# EAGLE schematic uTTA_V1_Measure (EAGLE 6.3)
VERSION: HW1.00
Assembly variants: Manual_Adjust, Controller Adjust

## Sheet 1 of 5: uC & Flash
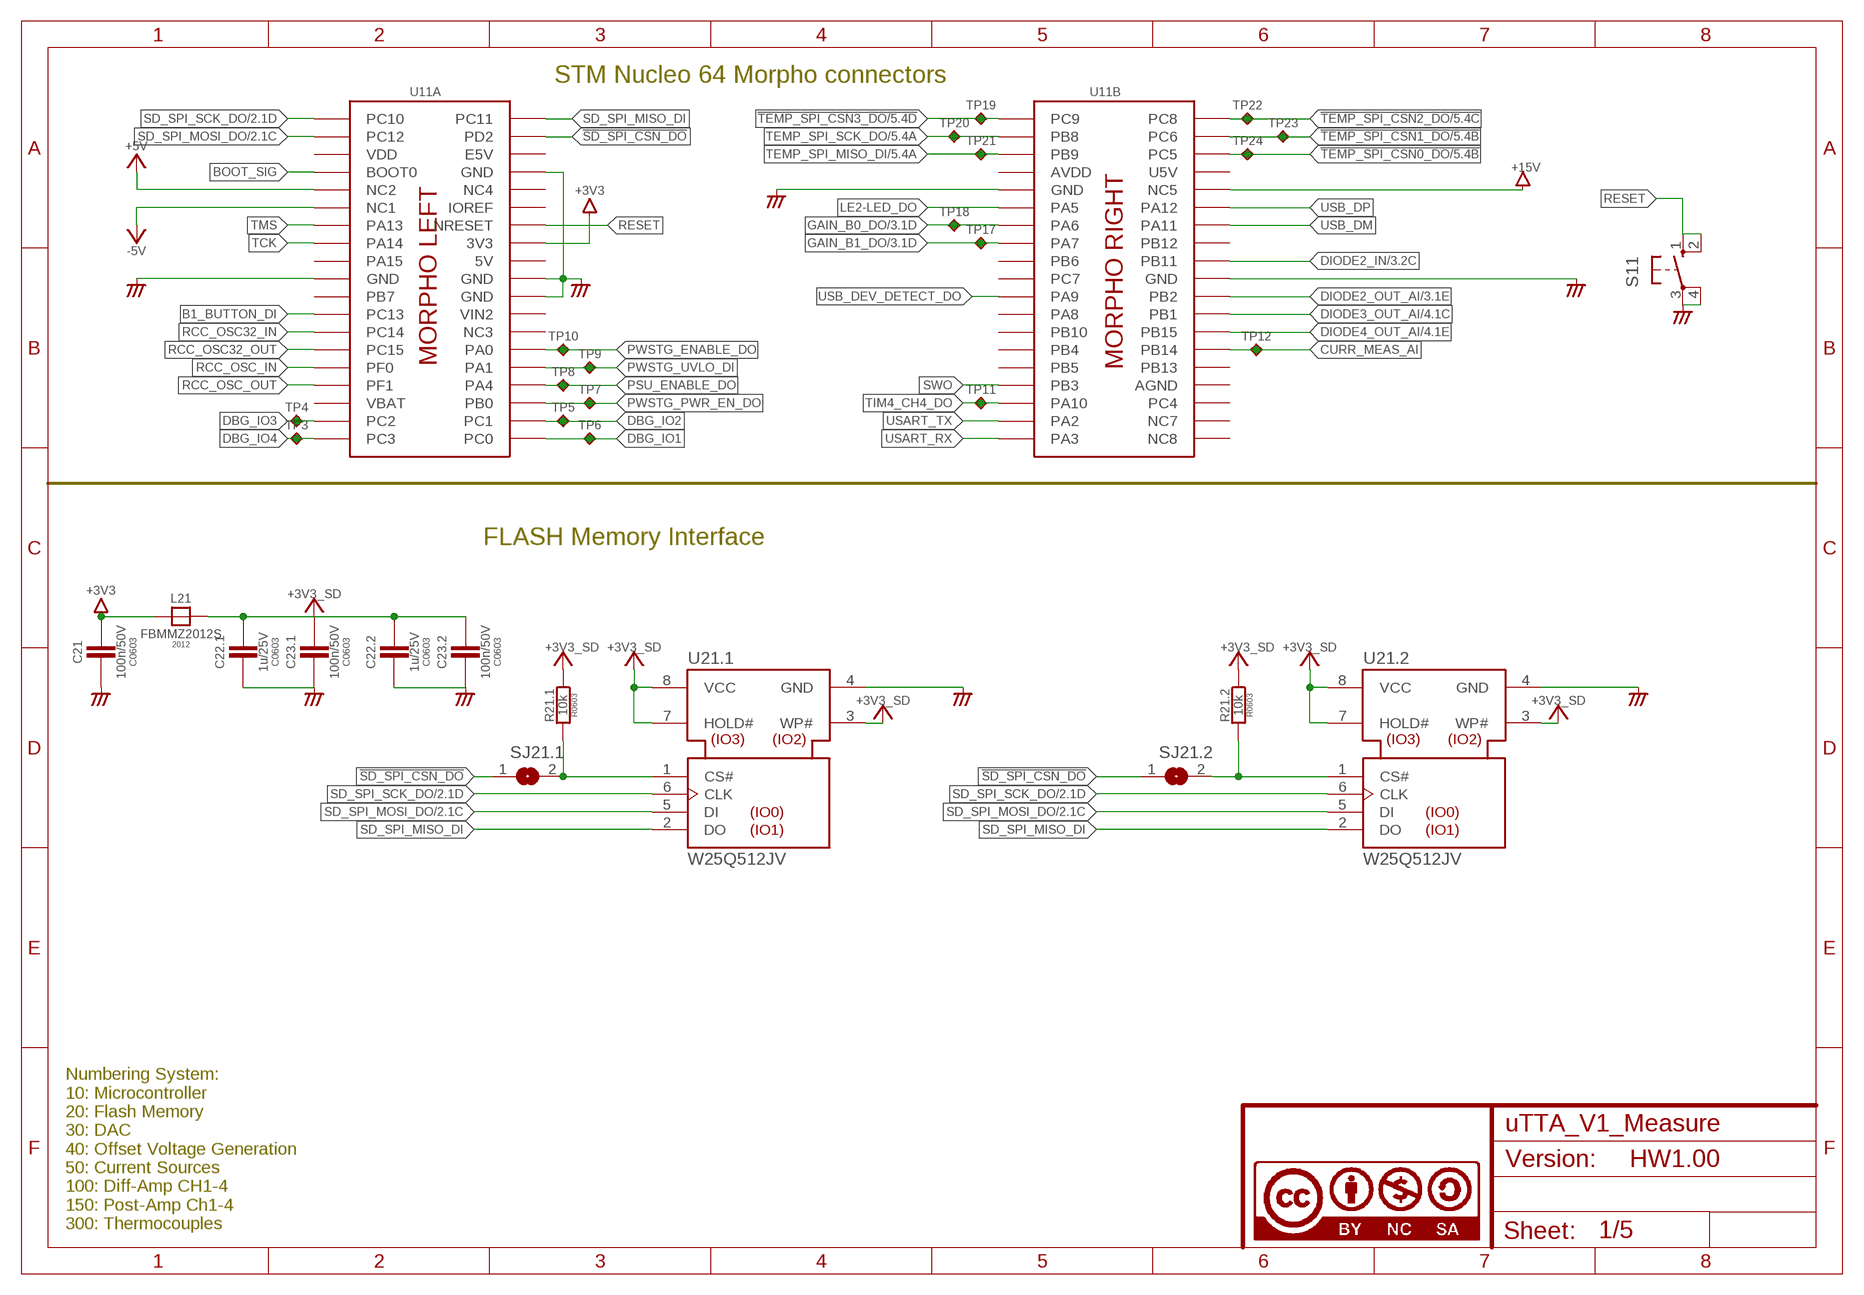
[diagram p0: schematic, sheet 1]

### Parts
C21  100n/50V  C-EUC0603  [C0603]
C22.1  1u/25V  C-EUC0603  [C0603]
C22.2  1u/25V  C-EUC0603  [C0603]
C23.1  100n/50V  C-EUC0603  [C0603]
C23.2  100n/50V  C-EUC0603  [C0603]
L21  FBMMZ2012S  [FB2012]
R21.1  10k  R-EU_R0603  [R0603]
R21.2  10k  R-EU_R0603  [R0603]
S11  10-XX  [B3F-10XX]
SJ21.1  SJ  [SJ]
SJ21.2  SJ  [SJ]
TP3  TPC90H30  [C90H30]
TP4  TPC90H30  [C90H30]
TP5  TPC90H30  [C90H30]
TP6  TPC90H30  [C90H30]
TP7  TPC90H30  [C90H30]
TP8  TPC90H30  [C90H30]
TP9  TPC90H30  [C90H30]
TP10  TPC90H30  [C90H30]
TP11  TPC90H30  [C90H30]
TP12  TPC90H30  [C90H30]
TP17  TPC90H30  [C90H30]
TP18  TPC90H30  [C90H30]
TP19  TPC90H30  [C90H30]
TP20  TPC90H30  [C90H30]
TP21  TPC90H30  [C90H30]
TP22  TPC90H30  [C90H30]
TP23  TPC90H30  [C90H30]
TP24  TPC90H30  [C90H30]
U11  NUCLEO_F103_BOT  [NUCLEO_BRD64_LOWER]
U21.1  W25Q512JV  W25Q80BVSSIG  [SO08W]
U21.2  W25Q512JV  W25Q80BVSSIG  [SO08W]
U$3  A4L-LOC_CC_BY_NC_SA  [A4_LOC_CC_BY_NC_SA]

### Nets
!SD_SPI_CSN_DO [Power]: SJ21.1.1 SJ21.2.1 U11.L_PD2(A:PD2)
!TEMP_SPI_CSN0_DO [Power]: TP24.P$1(TP) U11.R_PC5(B:PC5) ; also sheet 5
!TEMP_SPI_CSN1_DO [Power]: TP23.P$1(TP) U11.R_PC6(B:PC6) ; also sheet 5
!TEMP_SPI_CSN2_DO [Power]: TP22.P$1(TP) U11.R_PC8(B:PC8) ; also sheet 5
!TEMP_SPI_CSN3_DO [Power]: TP19.P$1(TP) U11.R_PC9(B:PC9) ; also sheet 5
+3V3: C21.1 L21.1 U11.L_3V3(A:3V3) ; also sheet 2,3,4,5
+5V [Analog_Sig]: U11.L_NC2(A:NC2) ; also sheet 2,3,4
+5V/4 [Analog_Sig]: C22.1.1 C22.2.1 C23.1.1 C23.2.1 L21.2 R21.1.1 R21.2.1 U21.1.3(WP#) U21.1.7(HOLD#) U21.1.8(VCC) U21.2.3(WP#) U21.2.7(HOLD#) U21.2.8(VCC) ; supply symbol labelled +3V3_SD
+15V [Analog_Sig]: U11.R_NC5(B:NC5)
-5V [Analog_Sig]: U11.L_NC1(A:NC1) ; also sheet 2,3,4
AGND [Analog_Sig]: C21.2 C22.1.2 C22.2.2 C23.1.2 C23.2.2 S11.3(P) S11.4(P1) U11.L_GND3(A:GND) U11.L_GND4(A:GND) U11.L_GND5(A:GND) U11.L_GND(A:GND) U11.R_GND7(B:GND) U11.R_GND8(B:GND) U21.1.4(GND) U21.2.4(GND) ; supply symbol labelled AGND_ ; also sheet 2,3,4,5
B1_BUTTON_DI: U11.L_PC13(A:PC13)
BOOT_SIG: U11.L_BOOT0(A:BOOT0)
CURR_MEAS_AI [Digital_Sig]: TP12.P$1(TP) U11.R_PB14(B:PB14)
DBG_IO1: TP6.P$1(TP) U11.L_PC0(A:PC0)
DBG_IO2: TP5.P$1(TP) U11.L_PC1(A:PC1)
DBG_IO3: TP4.P$1(TP) U11.L_PC2(A:PC2)
DBG_IO4: TP3.P$1(TP) U11.L_PC3(A:PC3)
DIODE2_IN [Analog_Sig]: U11.R_PB11(B:PB11) ; also sheet 3
DIODE2_OUT_AI [Digital_Sig]: U11.R_PB2(B:PB2) ; also sheet 3
DIODE3_OUT_AI [Digital_Sig]: U11.R_PB1(B:PB1) ; also sheet 4
DIODE4_OUT_AI [Digital_Sig]: U11.R_PB15(B:PB15) ; also sheet 4
GAIN_B0_DO [Power]: TP18.P$1(TP) U11.R_PA6(B:PA6) ; also sheet 3
GAIN_B1_DO [Power]: TP17.P$1(TP) U11.R_PA7(B:PA7) ; also sheet 3
LE2-LED_DO: U11.R_PA5(B:PA5)
N$5: R21.1.2 SJ21.1.2 U21.1.1(CS#)
N$6: R21.2.2 SJ21.2.2 U21.2.1(CS#)
PSU_ENABLE_DO: TP8.P$1(TP) U11.L_PA4(A:PA4)
PWSTG_ENABLE_DO: TP10.P$1(TP) U11.L_PA0(A:PA0)
PWSTG_PWR_EN_DO: TP7.P$1(TP) U11.L_PB0(A:PB0)
PWSTG_UVLO_DI: TP9.P$1(TP) U11.L_PA1(A:PA1)
RCC_OSC32_IN: U11.L_PC14(A:PC14)
RCC_OSC32_OUT: U11.L_PC15(A:PC15)
RCC_OSC_IN: U11.L_PF0(A:PF0)
RCC_OSC_OUT: U11.L_PF1(A:PF1)
RESET [Power]: S11.1(S) S11.2(S1) U11.L_RESET(A:NRESET)
SD_SPI_MISO_DI [Power]: U11.L_PC11(A:PC11) U21.1.2(DO) U21.2.2(DO)
SD_SPI_MOSI_DO [Power]: U11.L_PC12(A:PC12) U21.1.5(DI) U21.2.5(DI) ; also sheet 2
SD_SPI_SCK_DO [Power]: U11.L_PC10(A:PC10) U21.1.6(CLK) U21.2.6(CLK) ; also sheet 2
SWO: U11.R_PB3(B:PB3)
TCK: U11.L_PA14(A:PA14)
TEMP_SPI_MISO_DI [Power]: TP21.P$1(TP) U11.R_PB9(B:PB9) ; also sheet 5
TEMP_SPI_SCK_DO [Power]: TP20.P$1(TP) U11.R_PB8(B:PB8) ; also sheet 5
TIM4_CH4_DO [Power]: TP11.P$1(TP) U11.R_PA10(B:PA10)
TMS: U11.L_PA13(A:PA13)
USART_RX: U11.R_PA3(B:PA3)
USART_TX: U11.R_PA2(B:PA2)
USB_DEV_DETECT_DO: U11.R_PA9(B:PA9)
USB_DM: U11.R_PA11(B:PA11)
USB_DP: U11.R_PA12(B:PA12)
Unconnected: U11.L_IOREF(A:IOREF) U11.L_NC3(A:NC3) U11.L_NC4(A:NC4) U11.L_PA15(A:PA15) U11.L_PB7(A:PB7) U11.R_NC7(B:NC7) U11.R_NC8(B:NC8) U11.R_PA8(B:PA8) U11.R_PB4(B:PB4) U11.R_PB5(B:PB5) U11.R_PB6(B:PB6) U11.R_PB10(B:PB10) U11.R_PB12(B:PB12) U11.R_PB13(B:PB13) U11.R_PC4(B:PC4) U11.R_PC7(B:PC7)

### Notes on the sheet
- STM Nucleo 64 Morpho connectors
- FLASH Memory Interface
- Numbering System:
  10: Microcontroller
  20: Flash Memory
  30: DAC
  40: Offset Voltage Generation
  50: Current Sources
  100: Diff-Amp CH1-4
  150: Post-Amp Ch1-4
  300: Thermocouples

## Sheet 2 of 5
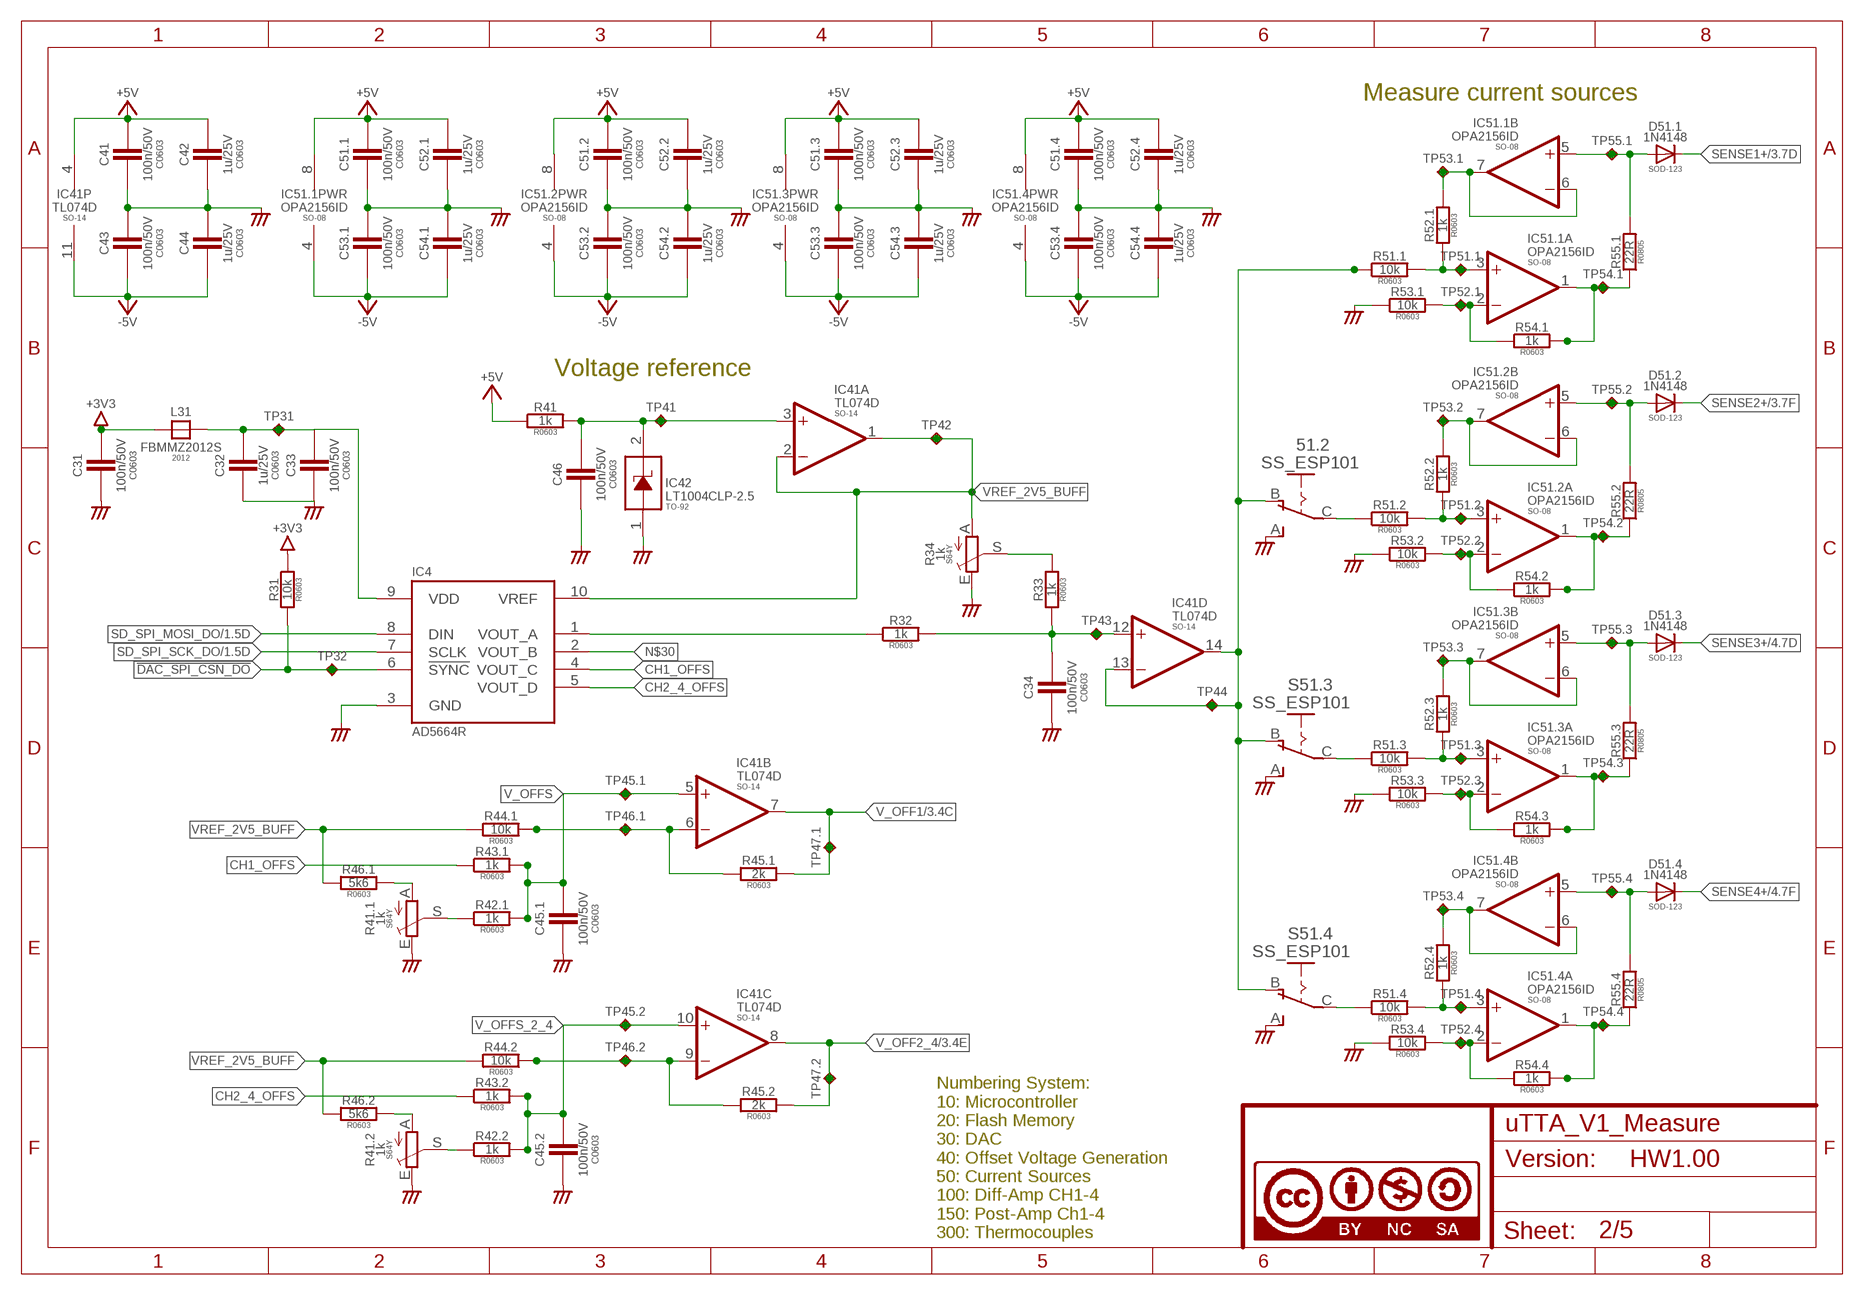
[diagram p1: schematic, sheet 2]

### Parts
51.2  SS_ESP101  [SS_ESP101]
C31  100n/50V  C-EUC0603  [C0603]  (not fitted in variant Manual_Adjust)
C32  1u/25V  C-EUC0603  [C0603]
C33  100n/50V  C-EUC0603  [C0603]  (not fitted in variant Manual_Adjust)
C34  100n/50V  C-EUC0603  [C0603]
C41  100n/50V  C-EUC0603  [C0603]
C42  1u/25V  C-EUC0603  [C0603]
C43  100n/50V  C-EUC0603  [C0603]
C44  1u/25V  C-EUC0603  [C0603]
C45.1  100n/50V  C-EUC0603  [C0603]
C45.2  100n/50V  C-EUC0603  [C0603]
C46  100n/50V  C-EUC0603  [C0603]
C51.1  100n/50V  C-EUC0603  [C0603]
C51.2  100n/50V  C-EUC0603  [C0603]
C51.3  100n/50V  C-EUC0603  [C0603]
C51.4  100n/50V  C-EUC0603  [C0603]
C52.1  1u/25V  C-EUC0603  [C0603]
C52.2  1u/25V  C-EUC0603  [C0603]
C52.3  1u/25V  C-EUC0603  [C0603]
C52.4  1u/25V  C-EUC0603  [C0603]
C53.1  100n/50V  C-EUC0603  [C0603]
C53.2  100n/50V  C-EUC0603  [C0603]
C53.3  100n/50V  C-EUC0603  [C0603]
C53.4  100n/50V  C-EUC0603  [C0603]
C54.1  1u/25V  C-EUC0603  [C0603]
C54.2  1u/25V  C-EUC0603  [C0603]
C54.3  1u/25V  C-EUC0603  [C0603]
C54.4  1u/25V  C-EUC0603  [C0603]
D51.1  1N4148  DIODE-SOD123  [SOD123]
D51.2  1N4148  DIODE-SOD123  [SOD123]
D51.3  1N4148  DIODE-SOD123  [SOD123]
D51.4  1N4148  DIODE-SOD123  [SOD123]
IC4  AD5664R  [MSOP10]  (not fitted in variant Manual_Adjust)
IC41  TL074D  [SO14]
IC42  LT1004CLP-2.5  [TO92-]
IC51.1  OPA2156ID  [SO08]
IC51.2  OPA2156ID  [SO08]
IC51.3  OPA2156ID  [SO08]
IC51.4  OPA2156ID  [SO08]
L31  FBMMZ2012S  [FB2012]  (not fitted in variant Manual_Adjust)
R31  10k  R-EU_R0603  [R0603]  (not fitted in variant Manual_Adjust)
R32  1k  R-EU_R0603  [R0603]  (not fitted in variant Manual_Adjust)
R33  1k  R-EU_R0603  [R0603]  (not fitted in variant Controller Adjust)
R34  1k  TRIM_EU-S64Y  [S64Y]  (not fitted in variant Controller Adjust)
R41  1k  R-EU_R0603  [R0603]
R41.1  1k  TRIM_EU-S64Y  [S64Y]  (not fitted in variant Controller Adjust)
R41.2  1k  TRIM_EU-S64Y  [S64Y]  (not fitted in variant Controller Adjust)
R42.1  1k  R-EU_R0603  [R0603]  (not fitted in variant Controller Adjust)
R42.2  1k  R-EU_R0603  [R0603]  (not fitted in variant Controller Adjust)
R43.1  1k  R-EU_R0603  [R0603]  (not fitted in variant Manual_Adjust)
R43.2  1k  R-EU_R0603  [R0603]  (not fitted in variant Manual_Adjust)
R44.1  10k  R-EU_R0603  [R0603]
R44.2  10k  R-EU_R0603  [R0603]
R45.1  2k  R-EU_R0603  [R0603]
R45.2  2k  R-EU_R0603  [R0603]
R46.1  5k6  R-EU_R0603  [R0603]
R46.2  5k6  R-EU_R0603  [R0603]
R51.1  10k  R-EU_R0603  [R0603]
R51.2  10k  R-EU_R0603  [R0603]
R51.3  10k  R-EU_R0603  [R0603]
R51.4  10k  R-EU_R0603  [R0603]
R52.1  1k  R-EU_R0603  [R0603]
R52.2  1k  R-EU_R0603  [R0603]
R52.3  1k  R-EU_R0603  [R0603]
R52.4  1k  R-EU_R0603  [R0603]
R53.1  10k  R-EU_R0603  [R0603]
R53.2  10k  R-EU_R0603  [R0603]
R53.3  10k  R-EU_R0603  [R0603]
R53.4  10k  R-EU_R0603  [R0603]
R54.1  1k  R-EU_R0603  [R0603]
R54.2  1k  R-EU_R0603  [R0603]
R54.3  1k  R-EU_R0603  [R0603]
R54.4  1k  R-EU_R0603  [R0603]
R55.1  22R  R-EU_R0805  [R0805]
R55.2  22R  R-EU_R0805  [R0805]
R55.3  22R  R-EU_R0805  [R0805]
R55.4  22R  R-EU_R0805  [R0805]
S51.3  SS_ESP101  [SS_ESP101]
S51.4  SS_ESP101  [SS_ESP101]
TP31  TP  [C90]
TP32  TP  [C90]
TP41  TP  [C90]
TP42  TP  [C90]
TP43  TP  [C90]
TP44  TP  [C90]
TP45.1  TP  [C90]
TP45.2  TP  [C90]
TP46.1  TP  [C90]
TP46.2  TP  [C90]
TP47.1  TP  [C90]
TP47.2  TP  [C90]
TP51.1  TP  [C90]
TP51.2  TP  [C90]
TP51.3  TP  [C90]
TP51.4  TP  [C90]
TP52.1  TP  [C90]
TP52.2  TP  [C90]
TP52.3  TP  [C90]
TP52.4  TP  [C90]
TP53.1  TP  [C90]
TP53.2  TP  [C90]
TP53.3  TP  [C90]
TP53.4  TP  [C90]
TP54.1  TP  [C90]
TP54.2  TP  [C90]
TP54.3  TP  [C90]
TP54.4  TP  [C90]
TP55.1  TP  [C90]
TP55.2  TP  [C90]
TP55.3  TP  [C90]
TP55.4  TP  [C90]
U$10  A4L-LOC_CC_BY_NC_SA  [A4_LOC_CC_BY_NC_SA]

### Nets
!DAC_SPI_CSN_DO [Power]: IC4.6(!SYNC) R31.2 TP32.P$1(TP)
+3V3: C31.1 L31.1 R31.1 ; also sheet 1,3,4,5
+5V [Analog_Sig]: C41.1 C42.1 C51.1.1 C51.2.1 C51.3.1 C51.4.1 C52.1.1 C52.2.1 C52.3.1 C52.4.1 IC41.4(P:V+) IC51.1.8(PWR:V+) IC51.2.8(PWR:V+) IC51.3.8(PWR:V+) IC51.4.8(PWR:V+) R41.1 ; also sheet 1,3,4
-5V [Analog_Sig]: C43.2 C44.2 C53.1.2 C53.2.2 C53.3.2 C53.4.2 C54.1.2 C54.2.2 C54.3.2 C54.4.2 IC41.11(P:V-) IC51.1.4(PWR:V-) IC51.2.4(PWR:V-) IC51.3.4(PWR:V-) IC51.4.4(PWR:V-) ; also sheet 1,3,4
AGND [Analog_Sig]: 51.2.A(S) C31.2 C32.2 C33.2 C34.2 C41.2 C42.2 C43.1 C44.1 C45.1.2 C45.2.2 C46.2 C51.1.2 C51.2.2 C51.3.2 C51.4.2 C52.1.2 C52.2.2 C52.3.2 C52.4.2 C53.1.1 C53.2.1 C53.3.1 C53.4.1 C54.1.1 C54.2.1 C54.3.1 C54.4.1 IC4.3(GND) IC42.1(A) R34.E R41.1.E R41.2.E R53.1.1 R53.2.1 R53.3.1 R53.4.1 S51.3.A(S) S51.4.A(S) ; supply symbol labelled AGND_ ; also sheet 1,3,4,5
CH1_OFFS: IC4.4(VOUT_C) R43.1.1
CH2_4_OFFS: IC4.5(VOUT_D) R43.2.1
N$3: C32.1 C33.1 IC4.9(VDD) L31.2 TP31.P$1(TP)
N$4: IC51.1.6(B:-IN) IC51.1.7(B:OUT) R52.1.2 TP53.1.P$1(TP)
N$7: IC51.2.6(B:-IN) IC51.2.7(B:OUT) R52.2.2 TP53.2.P$1(TP)
N$8: D51.2.A IC51.2.5(B:+IN) R55.2.2 TP55.2.P$1(TP)
N$9: IC51.2.1(A:OUT) R54.2.2 R55.2.1 TP54.2.P$1(TP)
N$10: D51.1.A IC51.1.5(B:+IN) R55.1.2 TP55.1.P$1(TP)
N$11: IC51.1.1(A:OUT) R54.1.2 R55.1.1 TP54.1.P$1(TP)
N$12: IC51.1.3(A:+IN) R51.1.2 R52.1.1 TP51.1.P$1(TP)
N$13: IC51.1.2(A:-IN) R53.1.2 R54.1.1 TP52.1.P$1(TP)
N$14: IC51.2.3(A:+IN) R51.2.2 R52.2.1 TP51.2.P$1(TP)
N$15: IC51.2.2(A:-IN) R53.2.2 R54.2.1 TP52.2.P$1(TP)
N$16: IC51.3.6(B:-IN) IC51.3.7(B:OUT) R52.3.2 TP53.3.P$1(TP)
N$17: D51.3.A IC51.3.5(B:+IN) R55.3.2 TP55.3.P$1(TP)
N$18: IC51.3.1(A:OUT) R54.3.2 R55.3.1 TP54.3.P$1(TP)
N$19: IC51.3.3(A:+IN) R51.3.2 R52.3.1 TP51.3.P$1(TP)
N$20: IC51.3.2(A:-IN) R53.3.2 R54.3.1 TP52.3.P$1(TP)
N$21: IC51.4.6(B:-IN) IC51.4.7(B:OUT) R52.4.2 TP53.4.P$1(TP)
N$22: D51.4.A IC51.4.5(B:+IN) R55.4.2 TP55.4.P$1(TP)
N$23: IC51.4.1(A:OUT) R54.4.2 R55.4.1 TP54.4.P$1(TP)
N$24: IC51.4.3(A:+IN) R51.4.2 R52.4.1 TP51.4.P$1(TP)
N$25: IC51.4.2(A:-IN) R53.4.2 R54.4.1 TP52.4.P$1(TP)
N$26: 51.2.C(P) R51.2.1
N$27: R51.3.1 S51.3.C(P)
N$28: R51.4.1 S51.4.C(P)
N$29: 51.2.B(O) IC41.13(D:-IN) IC41.14(D:OUT) R51.1.1 S51.3.B(O) S51.4.B(O) TP44.P$1(TP)
N$30: IC4.2(VOUT_B)
N$31: IC4.1(VOUT_A) R32.1
N$32: C34.1 IC41.12(D:+IN) R32.2 R33.2 TP43.P$1(TP)
N$34: R33.1 R34.S
SD_SPI_MOSI_DO [Power]: IC4.8(DIN) ; also sheet 1
SD_SPI_SCK_DO [Power]: IC4.7(SCLK) ; also sheet 1
SENSE1+ [Digital_Sig]: D51.1.C ; also sheet 3
SENSE2+ [Digital_Sig]: D51.2.C ; also sheet 3
SENSE3+ [Digital_Sig]: D51.3.C ; also sheet 4
SENSE4+ [Digital_Sig]: D51.4.C ; also sheet 4
V_OFF1 [Digital_Sig]: IC41.7(B:OUT) R45.1.1 TP47.1.P$1(TP) ; also sheet 3
V_OFF2_4 [Digital_Sig]: IC41.8(C:OUT) R45.2.1 TP47.2.P$1(TP) ; also sheet 3,4
V_OFFS [Digital_Sig]: C45.1.1 IC41.5(B:+IN) R42.1.2 R43.1.2 TP45.1.P$1(TP)
V_OFFS_2_4 [Digital_Sig]: C45.2.1 IC41.10(C:+IN) R42.2.2 R43.2.2 TP45.2.P$1(TP)
VOFFS_RR [Digital_Sig]: IC41.6(B:-IN) R44.1.1 R45.1.2 TP46.1.P$1(TP)
VOFFS_RR1 [Digital_Sig]: IC41.9(C:-IN) R44.2.1 R45.2.2 TP46.2.P$1(TP)
VREF [Digital_Sig]: C46.1 IC41.3(A:+IN) IC42.2(C) R41.2 TP41.P$1(TP)
VREF_2V5_BUFF [Digital_Sig]: IC4.10(VREF) IC41.1(A:OUT) IC41.2(A:-IN) R34.A R44.1.2 R44.2.2 R46.1.2 R46.2.2 TP42.P$1(TP)
VREF_RR1 [Analog_Sig]: R41.1.A R46.1.1
VREF_RR2 [Analog_Sig]: R41.2.A R46.2.1
VREF_TRIM [Digital_Sig]: R41.1.S R42.1.1
VREF_TRIM1 [Digital_Sig]: R41.2.S R42.2.1

### Notes on the sheet
- Measure current sources
- Voltage reference
- Numbering System:
  10: Microcontroller
  20: Flash Memory
  30: DAC
  40: Offset Voltage Generation
  50: Current Sources
  100: Diff-Amp CH1-4
  150: Post-Amp Ch1-4
  300: Thermocouples

## Sheet 3 of 5: Measure Channels 1 & 2
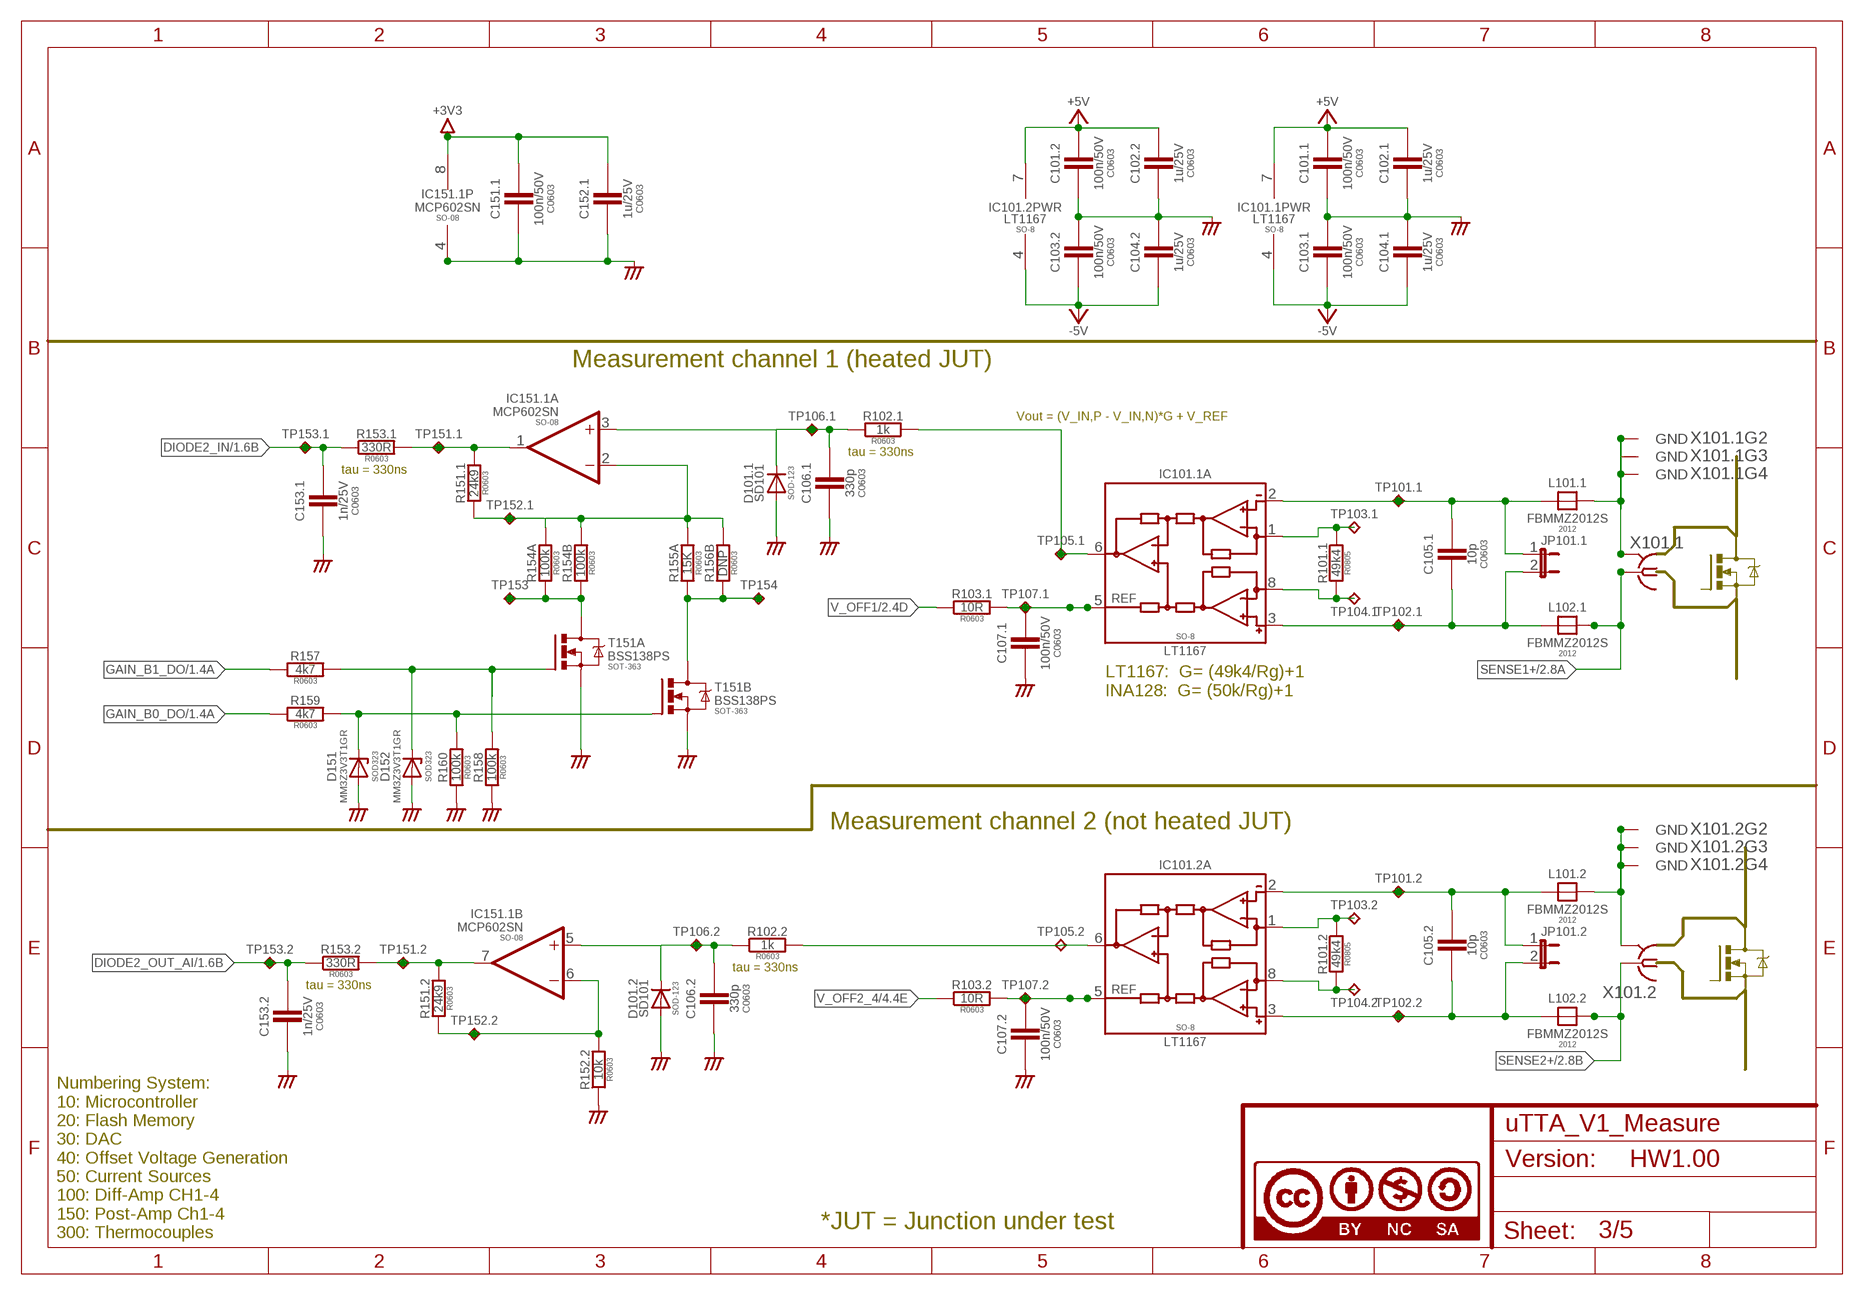
[diagram p2: schematic, sheet 3]

### Parts
C101.1  100n/50V  C-EUC0603  [C0603]
C101.2  100n/50V  C-EUC0603  [C0603]
C102.1  1u/25V  C-EUC0603  [C0603]
C102.2  1u/25V  C-EUC0603  [C0603]
C103.1  100n/50V  C-EUC0603  [C0603]
C103.2  100n/50V  C-EUC0603  [C0603]
C104.1  1u/25V  C-EUC0603  [C0603]
C104.2  1u/25V  C-EUC0603  [C0603]
C105.1  10p  C-EUC0603  [C0603]
C105.2  10p  C-EUC0603  [C0603]
C106.1  330p  C-EUC0603  [C0603]
C106.2  330p  C-EUC0603  [C0603]
C107.1  100n/50V  C-EUC0603  [C0603]
C107.2  100n/50V  C-EUC0603  [C0603]
C151.1  100n/50V  C-EUC0603  [C0603]
C152.1  1u/25V  C-EUC0603  [C0603]
C153.1  1n/25V  C-EUC0603  [C0603]
C153.2  1n/25V  C-EUC0603  [C0603]
D101.1  SD101  DIODE-SOD123  [SOD123]
D101.2  SD101  DIODE-SOD123  [SOD123]
D151  MM3Z3V3T1GR  [SOD323-R]
D152  MM3Z3V3T1GR  [SOD323-R]
IC101.1  LT1167  [SO08]
IC101.2  LT1167  [SO08]
IC151.1  MCP602SN  [SO08]
JP101.1  JP1E  [JP1]
JP101.2  JP1E  [JP1]
L101.1  FBMMZ2012S  [FB2012]
L101.2  FBMMZ2012S  [FB2012]
L102.1  FBMMZ2012S  [FB2012]
L102.2  FBMMZ2012S  [FB2012]
R101.1  49k4  R-EU_R0805  [R0805]
R101.2  49k4  R-EU_R0805  [R0805]
R102.1  1k  R-EU_R0603  [R0603]
R102.2  1k  R-EU_R0603  [R0603]
R103.1  10R  R-EU_R0603  [R0603]
R103.2  10R  R-EU_R0603  [R0603]
R151.1  24k9  R-EU_R0603  [R0603]
R151.2  24k9  R-EU_R0603  [R0603]
R152.2  10k  R-EU_R0603  [R0603]
R153.1  330R  R-EU_R0603  [R0603]
R153.2  330R  R-EU_R0603  [R0603]
R154A  100k  R-EU_R0603  [R0603]
R154B  100k  R-EU_R0603  [R0603]
R155A  15K  R-EU_R0603  [R0603]
R156B  DNP  R-EU_R0603  [R0603]
R157  4k7  R-EU_R0603  [R0603]
R158  100k  R-EU_R0603  [R0603]
R159  4k7  R-EU_R0603  [R0603]
R160  100k  R-EU_R0603  [R0603]
T151  BSS138PS  [SOT363_PHILIPS]
TP101.1  TP  [C90]
TP101.2  TP  [C90]
TP102.1  TP  [C90]
TP102.2  TP  [C90]
TP103.1  TP  [C90]
TP103.2  TP  [C90]
TP104.1  TP  [C90]
TP104.2  TP  [C90]
TP105.1  TP  [C90]
TP105.2  TP  [C90]
TP106.1  TPC90H30  [C90H30]
TP106.2  TPC90H30  [C90H30]
TP107.1  TP  [C90]
TP107.2  TP  [C90]
TP151.1  TP  [C90]
TP151.2  TP  [C90]
TP152.1  TP  [C90]
TP152.2  TP  [C90]
TP153  TP  [C90]
TP153.1  TPC90H30  [C90H30]
TP153.2  TPC90H30  [C90H30]
TP154  TP  [C90]
U$2  A4L-LOC_CC_BY_NC_SA  [A4_LOC_CC_BY_NC_SA]
X101.1  BU-SMA-GSPECIAL  [BU_SMA_3P]
X101.2  BU-SMA-GSPECIAL  [BU_SMA_3P]

### Nets
+3V3: C151.1.1 C152.1.1 IC151.1.8(P:V+) ; also sheet 1,2,4,5
+5V [Analog_Sig]: C101.1.1 C101.2.1 C102.1.1 C102.2.1 IC101.1.7(PWR:V+) IC101.2.7(PWR:V+) ; also sheet 1,2,4
-5V [Analog_Sig]: C103.1.2 C103.2.2 C104.1.2 C104.2.2 IC101.1.4(PWR:V-) IC101.2.4(PWR:V-) ; also sheet 1,2,4
AGND [Analog_Sig]: C101.1.2 C101.2.2 C102.1.2 C102.2.2 C103.1.1 C103.2.1 C104.1.1 C104.2.1 C106.1.2 C106.2.2 C107.1.2 C107.2.2 C151.1.2 C152.1.2 C153.1.2 C153.2.2 D101.1.A D101.2.A D151.A D152.A IC151.1.4(P:V-) R152.2.1 R158.1 R160.1 T151.1(A:S) T151.4(B:S) ; supply symbol labelled AGND_ ; also sheet 1,2,4,5
AMP1_OUT [Digital_Sig]: IC151.1.1(A:OUT) R151.1.2 R153.1.2 TP151.1.P$1(TP)
AMP1_RG_B0 [Digital_Sig]: R155A.1 R156B.1 T151.6(B:D) TP154.P$1(TP)
AMP1_RG_B1 [Digital_Sig]: R154A.1 R154B.1 T151.3(A:D) TP153.P$1(TP)
AMP2_FB [Digital_Sig]: IC151.1.6(B:-IN) R151.2.1 R152.2.2 TP152.2.P$1(TP)
AMP2_OUT [Digital_Sig]: IC151.1.7(B:OUT) R151.2.2 R153.2.2 TP151.2.P$1(TP)
B0_GATE [Power]: D151.C R159.2 R160.2 T151.5(B:G)
B1_GATE [Power]: D152.C R157.2 R158.2 T151.2(A:G)
DIFF_AMP1_OUT [Analog_Sig]: IC101.1.6(A:OUT) R102.1.2 TP105.1.P$1(TP)
DIFF_AMP2_OUT [Digital_Sig]: IC101.2.6(A:OUT) R102.2.2 TP105.2.P$1(TP)
DIODE2_IN [Analog_Sig]: C106.2.1 C153.1.1 D101.2.C IC151.1.5(B:+IN) R102.2.1 R153.1.1 TP106.2.P$1(TP) TP153.1.P$1(TP) ; also sheet 1
DIODE2_OUT_AI [Digital_Sig]: C153.2.1 R153.2.1 TP153.2.P$1(TP) ; also sheet 1
GAIN1+ [Digital_Sig]: IC101.1.8(A:RG) R101.1.2 TP104.1.P$1(TP)
GAIN1- [Digital_Sig]: IC101.1.1(A:RG) R101.1.1 TP103.1.P$1(TP)
GAIN2+ [Digital_Sig]: IC101.2.8(A:RG) R101.2.2 TP104.2.P$1(TP)
GAIN2- [Digital_Sig]: IC101.2.1(A:RG) R101.2.1 TP103.2.P$1(TP)
GAIN_B0_DO [Power]: R159.1 ; also sheet 1
GAIN_B1_DO [Power]: R157.1 ; also sheet 1
IN1+ [Digital_Sig]: C105.1.2 IC101.1.3(A:+IN) JP101.1.2 L102.1.1 TP102.1.P$1(TP)
IN1- [Digital_Sig]: C105.1.1 IC101.1.2(A:-IN) JP101.1.1 L101.1.1 TP101.1.P$1(TP)
IN2+ [Digital_Sig]: C105.2.2 IC101.2.3(A:+IN) JP101.2.2 L102.2.1 TP102.2.P$1(TP)
IN2- [Digital_Sig]: C105.2.1 IC101.2.2(A:-IN) JP101.2.1 L101.2.1 TP101.2.P$1(TP)
PGA_DIODE1_IN [Analog_Sig]: C106.1.1 D101.1.C IC151.1.3(A:+IN) R102.1.1 TP106.1.P$1(TP)
SENSE1+ [Digital_Sig]: L102.1.2 X101.1.C1 X101.1.C2 ; also sheet 2
SENSE1- [Digital_Sig]: L101.1.2 X101.1.@GND1(GND) X101.1.@GND2(GND) X101.1.@GND3(GND) X101.1.@GND4(GND) X101.1.GND
SENSE2+ [Digital_Sig]: L102.2.2 X101.2.C1 X101.2.C2 ; also sheet 2
SENSE2- [Digital_Sig]: L101.2.2 X101.2.@GND1(GND) X101.2.@GND2(GND) X101.2.@GND3(GND) X101.2.@GND4(GND) X101.2.GND
TP152.1 [Digital_Sig]: IC151.1.2(A:-IN) R151.1.1 R154A.2 R154B.2 R155A.2 R156B.2 TP152.1.P$1(TP)
V_OFF1 [Digital_Sig]: R103.1.1 ; also sheet 2
V_OFF2_4 [Digital_Sig]: R103.2.1 ; also sheet 2,4
V_OPREF1 [Digital_Sig]: C107.1.1 IC101.1.5(A:REF) R103.1.2 TP107.1.P$1(TP)
V_OPREF2 [Digital_Sig]: C107.2.1 IC101.2.5(A:REF) R103.2.2 TP107.2.P$1(TP)

### Notes on the sheet
- Measurement channel 1 (heated JUT)
- Vout = (V_IN,P - V_IN,N)*G + V_REF
- tau = 330ns
- tau = 330ns
- LT1167:  G= (49k4/Rg)+1
  INA128:  G= (50k/Rg)+1
- Measurement channel 2 (not heated JUT)
- tau = 330ns
- tau = 330ns
- *JUT = Junction under test
- Numbering System:
  10: Microcontroller
  20: Flash Memory
  30: DAC
  40: Offset Voltage Generation
  50: Current Sources
  100: Diff-Amp CH1-4
  150: Post-Amp Ch1-4
  300: Thermocouples

## Sheet 4 of 5: Measure Channels 3 & 4
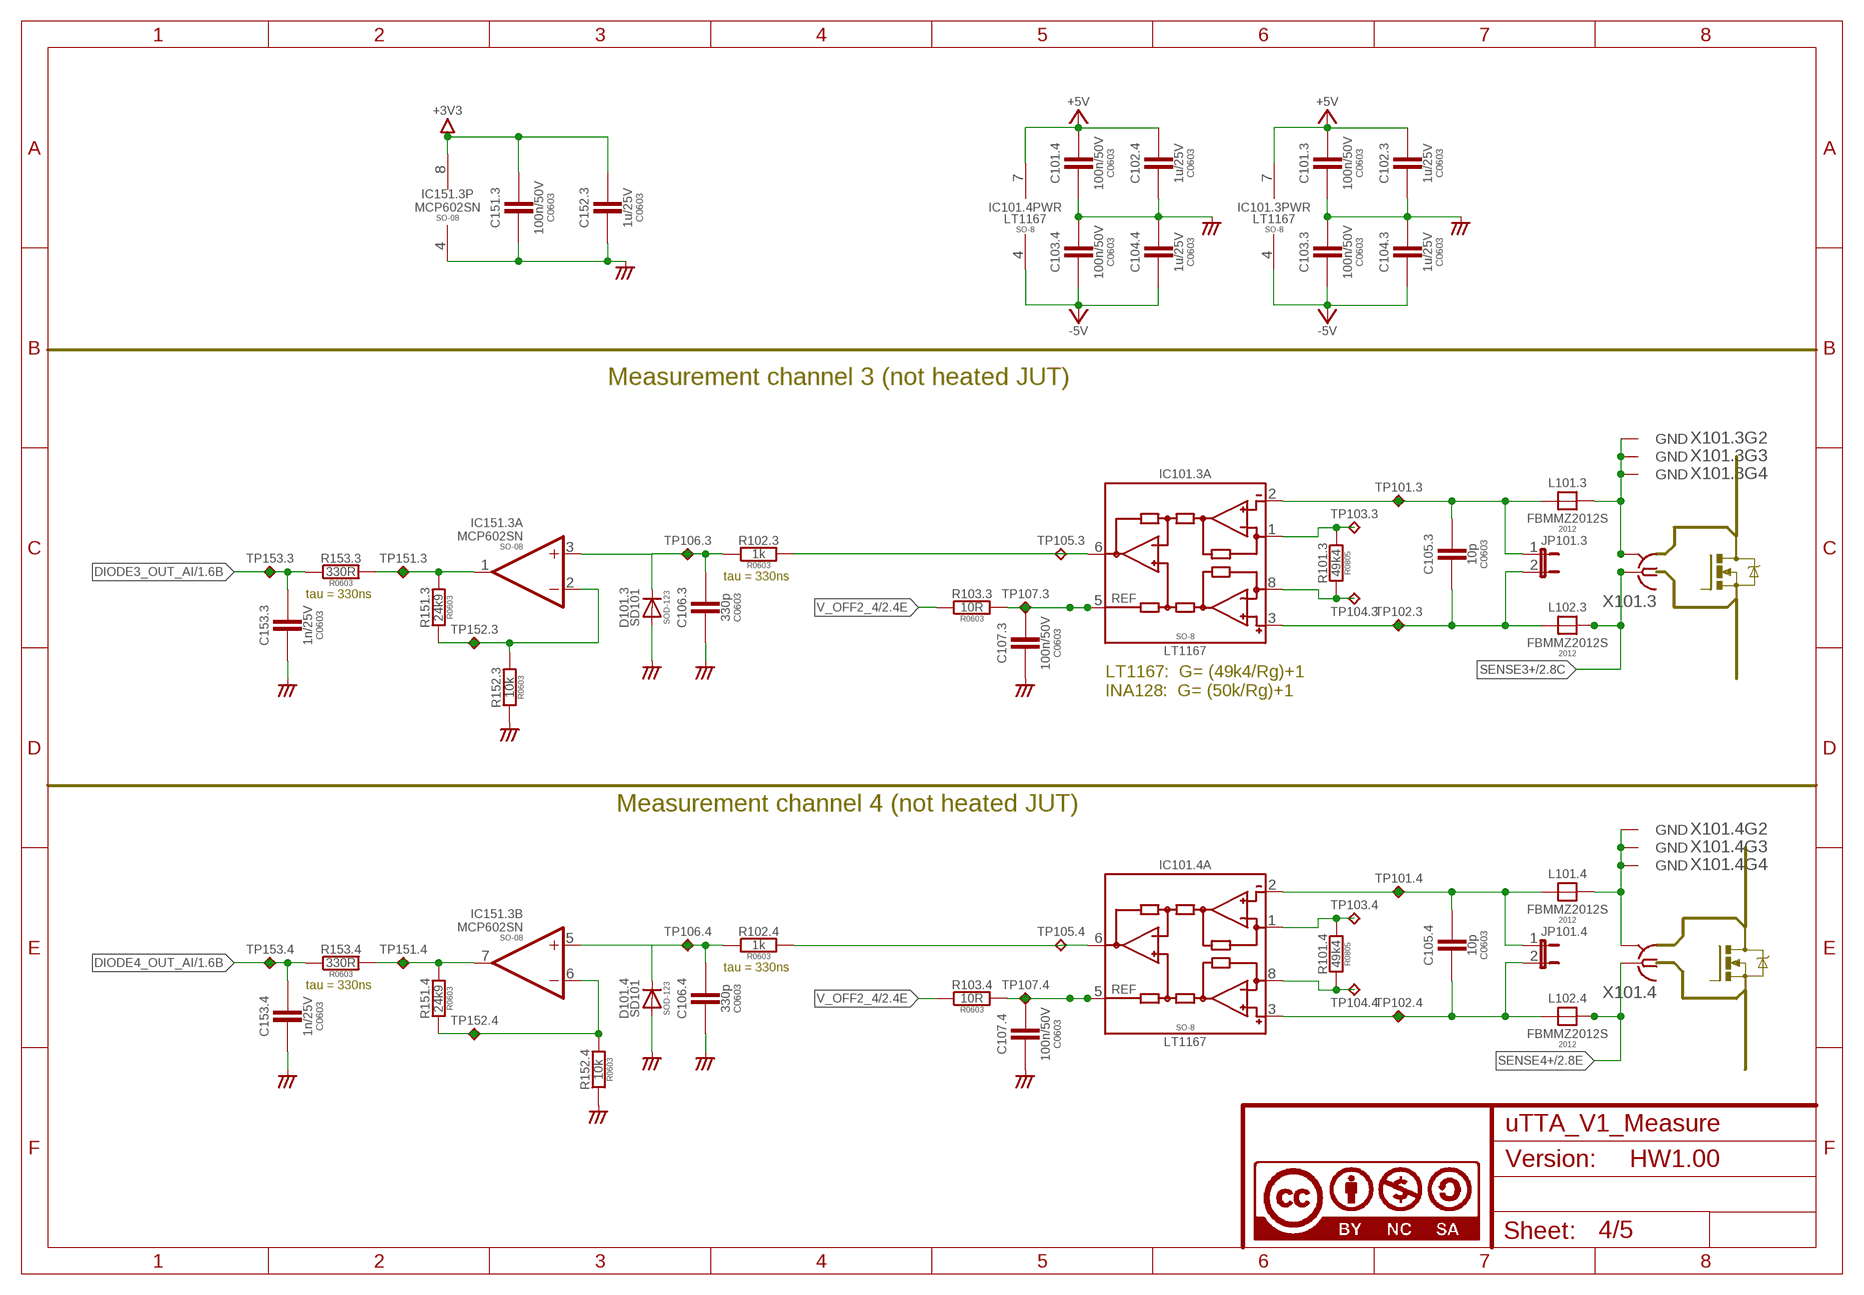
[diagram p3: schematic, sheet 4]

### Parts
C101.3  100n/50V  C-EUC0603  [C0603]
C101.4  100n/50V  C-EUC0603  [C0603]
C102.3  1u/25V  C-EUC0603  [C0603]
C102.4  1u/25V  C-EUC0603  [C0603]
C103.3  100n/50V  C-EUC0603  [C0603]
C103.4  100n/50V  C-EUC0603  [C0603]
C104.3  1u/25V  C-EUC0603  [C0603]
C104.4  1u/25V  C-EUC0603  [C0603]
C105.3  10p  C-EUC0603  [C0603]
C105.4  10p  C-EUC0603  [C0603]
C106.3  330p  C-EUC0603  [C0603]
C106.4  330p  C-EUC0603  [C0603]
C107.3  100n/50V  C-EUC0603  [C0603]
C107.4  100n/50V  C-EUC0603  [C0603]
C151.3  100n/50V  C-EUC0603  [C0603]
C152.3  1u/25V  C-EUC0603  [C0603]
C153.3  1n/25V  C-EUC0603  [C0603]
C153.4  1n/25V  C-EUC0603  [C0603]
D101.3  SD101  DIODE-SOD123  [SOD123]
D101.4  SD101  DIODE-SOD123  [SOD123]
IC101.3  LT1167  [SO08]
IC101.4  LT1167  [SO08]
IC151.3  MCP602SN  [SO08]
JP101.3  JP1E  [JP1]
JP101.4  JP1E  [JP1]
L101.3  FBMMZ2012S  [FB2012]
L101.4  FBMMZ2012S  [FB2012]
L102.3  FBMMZ2012S  [FB2012]
L102.4  FBMMZ2012S  [FB2012]
R101.3  49k4  R-EU_R0805  [R0805]
R101.4  49k4  R-EU_R0805  [R0805]
R102.3  1k  R-EU_R0603  [R0603]
R102.4  1k  R-EU_R0603  [R0603]
R103.3  10R  R-EU_R0603  [R0603]
R103.4  10R  R-EU_R0603  [R0603]
R151.3  24k9  R-EU_R0603  [R0603]
R151.4  24k9  R-EU_R0603  [R0603]
R152.3  10k  R-EU_R0603  [R0603]
R152.4  10k  R-EU_R0603  [R0603]
R153.3  330R  R-EU_R0603  [R0603]
R153.4  330R  R-EU_R0603  [R0603]
TP101.3  TP  [C90]
TP101.4  TP  [C90]
TP102.3  TP  [C90]
TP102.4  TP  [C90]
TP103.3  TP  [C90]
TP103.4  TP  [C90]
TP104.3  TP  [C90]
TP104.4  TP  [C90]
TP105.3  TP  [C90]
TP105.4  TP  [C90]
TP106.3  TPC90H30  [C90H30]
TP106.4  TPC90H30  [C90H30]
TP107.3  TP  [C90]
TP107.4  TP  [C90]
TP151.3  TP  [C90]
TP151.4  TPC90H30  [C90H30]
TP152.3  TPC90H30  [C90H30]
TP152.4  TPC90H30  [C90H30]
TP153.3  TPC90H30  [C90H30]
TP153.4  TPC90H30  [C90H30]
U$4  A4L-LOC_CC_BY_NC_SA  [A4_LOC_CC_BY_NC_SA]
X101.3  BU-SMA-GSPECIAL  [BU_SMA_3P]
X101.4  BU-SMA-GSPECIAL  [BU_SMA_3P]

### Nets
+3V3: C151.3.1 C152.3.1 IC151.3.8(P:V+) ; also sheet 1,2,3,5
+5V [Analog_Sig]: C101.3.1 C101.4.1 C102.3.1 C102.4.1 IC101.3.7(PWR:V+) IC101.4.7(PWR:V+) ; also sheet 1,2,3
-5V [Analog_Sig]: C103.3.2 C103.4.2 C104.3.2 C104.4.2 IC101.3.4(PWR:V-) IC101.4.4(PWR:V-) ; also sheet 1,2,3
AGND [Analog_Sig]: C101.3.2 C101.4.2 C102.3.2 C102.4.2 C103.3.1 C103.4.1 C104.3.1 C104.4.1 C106.3.2 C106.4.2 C107.3.2 C107.4.2 C151.3.2 C152.3.2 C153.3.2 C153.4.2 D101.3.A D101.4.A IC151.3.4(P:V-) R152.3.1 R152.4.1 ; supply symbol labelled AGND_ ; also sheet 1,2,3,5
AMP3_FB [Digital_Sig]: IC151.3.2(A:-IN) R151.3.1 R152.3.2 TP152.3.P$1(TP)
AMP3_OUT [Digital_Sig]: IC151.3.1(A:OUT) R151.3.2 R153.3.2 TP151.3.P$1(TP)
AMP4_FB [Digital_Sig]: IC151.3.6(B:-IN) R151.4.1 R152.4.2 TP152.4.P$1(TP)
AMP4_OUT [Digital_Sig]: IC151.3.7(B:OUT) R151.4.2 R153.4.2 TP151.4.P$1(TP)
DIFF_AMP3_OUT [Analog_Sig]: IC101.3.6(A:OUT) R102.3.2 TP105.3.P$1(TP)
DIFF_AMP4_OUT [Analog_Sig]: IC101.4.6(A:OUT) R102.4.2 TP105.4.P$1(TP)
DIODE3_IN [Analog_Sig]: C106.3.1 D101.3.C IC151.3.3(A:+IN) R102.3.1 TP106.3.P$1(TP)
DIODE3_OUT_AI [Digital_Sig]: C153.3.1 R153.3.1 TP153.3.P$1(TP) ; also sheet 1
DIODE4_IN [Analog_Sig]: C106.4.1 D101.4.C IC151.3.5(B:+IN) R102.4.1 TP106.4.P$1(TP)
DIODE4_OUT_AI [Digital_Sig]: C153.4.1 R153.4.1 TP153.4.P$1(TP) ; also sheet 1
GAIN3+ [Digital_Sig]: IC101.3.8(A:RG) R101.3.2 TP104.3.P$1(TP)
GAIN3- [Digital_Sig]: IC101.3.1(A:RG) R101.3.1 TP103.3.P$1(TP)
GAIN4+ [Digital_Sig]: IC101.4.8(A:RG) R101.4.2 TP104.4.P$1(TP)
GAIN4- [Digital_Sig]: IC101.4.1(A:RG) R101.4.1 TP103.4.P$1(TP)
IN3+ [Digital_Sig]: C105.3.2 IC101.3.3(A:+IN) JP101.3.2 L102.3.1 TP102.3.P$1(TP)
IN3- [Digital_Sig]: C105.3.1 IC101.3.2(A:-IN) JP101.3.1 L101.3.1 TP101.3.P$1(TP)
IN4+ [Digital_Sig]: C105.4.2 IC101.4.3(A:+IN) JP101.4.2 L102.4.1 TP102.4.P$1(TP)
IN4- [Digital_Sig]: C105.4.1 IC101.4.2(A:-IN) JP101.4.1 L101.4.1 TP101.4.P$1(TP)
SENSE3+ [Digital_Sig]: L102.3.2 X101.3.C1 X101.3.C2 ; also sheet 2
SENSE3- [Digital_Sig]: L101.3.2 X101.3.@GND1(GND) X101.3.@GND2(GND) X101.3.@GND3(GND) X101.3.@GND4(GND) X101.3.GND
SENSE4+ [Digital_Sig]: L102.4.2 X101.4.C1 X101.4.C2 ; also sheet 2
SENSE4- [Digital_Sig]: L101.4.2 X101.4.@GND1(GND) X101.4.@GND2(GND) X101.4.@GND3(GND) X101.4.@GND4(GND) X101.4.GND
V_OFF2_4 [Digital_Sig]: R103.3.1 R103.4.1 ; also sheet 2,3
V_OPREF3 [Digital_Sig]: C107.3.1 IC101.3.5(A:REF) R103.3.2 TP107.3.P$1(TP)
V_OPREF4 [Digital_Sig]: C107.4.1 IC101.4.5(A:REF) R103.4.2 TP107.4.P$1(TP)

### Notes on the sheet
- Measurement channel 3 (not heated JUT)
- tau = 330ns
- tau = 330ns
- LT1167:  G= (49k4/Rg)+1
  INA128:  G= (50k/Rg)+1
- Measurement channel 4 (not heated JUT)
- tau = 330ns
- tau = 330ns

## Sheet 5 of 5: Thermocouples
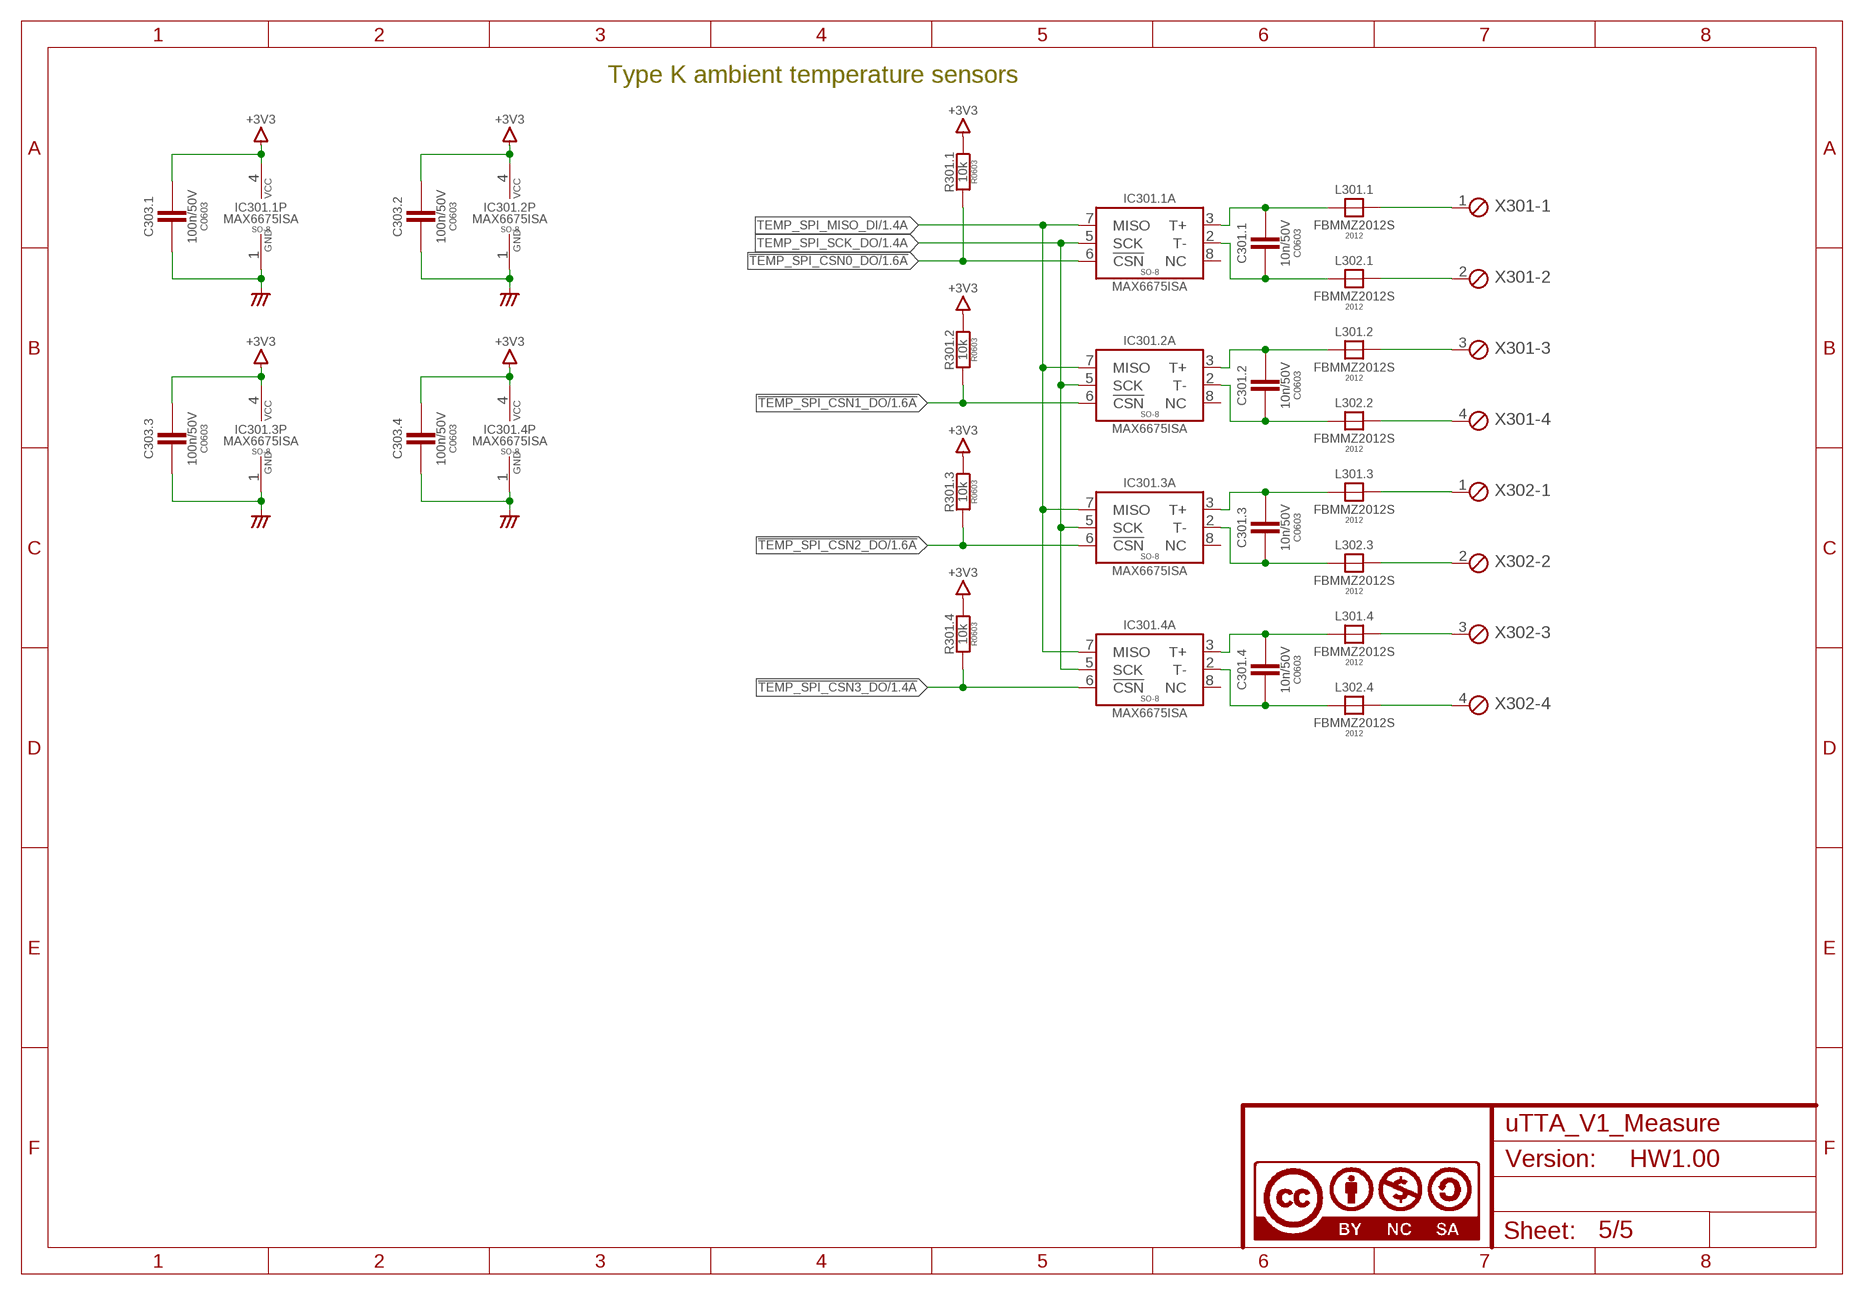
[diagram p4: schematic, sheet 5]

### Parts
C301.1  10n/50V  C-EUC0603  [C0603]
C301.2  10n/50V  C-EUC0603  [C0603]
C301.3  10n/50V  C-EUC0603  [C0603]
C301.4  10n/50V  C-EUC0603  [C0603]
C303.1  100n/50V  C-EUC0603  [C0603]
C303.2  100n/50V  C-EUC0603  [C0603]
C303.3  100n/50V  C-EUC0603  [C0603]
C303.4  100n/50V  C-EUC0603  [C0603]
IC301.1  MAX6675ISA  [SO08]
IC301.2  MAX6675ISA  [SO08]
IC301.3  MAX6675ISA  [SO08]
IC301.4  MAX6675ISA  [SO08]
L301.1  FBMMZ2012S  [FB2012]
L301.2  FBMMZ2012S  [FB2012]
L301.3  FBMMZ2012S  [FB2012]
L301.4  FBMMZ2012S  [FB2012]
L302.1  FBMMZ2012S  [FB2012]
L302.2  FBMMZ2012S  [FB2012]
L302.3  FBMMZ2012S  [FB2012]
L302.4  FBMMZ2012S  [FB2012]
R301.1  10k  R-EU_R0603  [R0603]
R301.2  10k  R-EU_R0603  [R0603]
R301.3  10k  R-EU_R0603  [R0603]
R301.4  10k  R-EU_R0603  [R0603]
U$9  A4L-LOC_CC_BY_NC_SA  [A4_LOC_CC_BY_NC_SA]
X301  MPT4  [4POL254]
X302  MPT4  [4POL254]

### Nets
!TEMP_SPI_CSN0_DO [Power]: IC301.1.6(A:!CSN) R301.1.2 ; also sheet 1
!TEMP_SPI_CSN1_DO [Power]: IC301.2.6(A:!CSN) R301.2.2 ; also sheet 1
!TEMP_SPI_CSN2_DO [Power]: IC301.3.6(A:!CSN) R301.3.2 ; also sheet 1
!TEMP_SPI_CSN3_DO [Power]: IC301.4.6(A:!CSN) R301.4.2 ; also sheet 1
+3V3: C303.1.1 C303.2.1 C303.3.1 C303.4.1 IC301.1.4(P:VCC) IC301.2.4(P:VCC) IC301.3.4(P:VCC) IC301.4.4(P:VCC) R301.1.1 R301.2.1 R301.3.1 R301.4.1 ; also sheet 1,2,3,4
AGND [Analog_Sig]: C303.1.2 C303.2.2 C303.3.2 C303.4.2 IC301.1.1(P:GND) IC301.2.1(P:GND) IC301.3.1(P:GND) IC301.4.1(P:GND) ; supply symbol labelled AGND_ ; also sheet 1,2,3,4
TC1+: L301.1.2 X301.1
TC1-: L302.1.2 X301.2
TC2+: L301.2.2 X301.3
TC2-: L302.2.2 X301.4
TC3+: L301.3.2 X302.1
TC3-: L302.3.2 X302.2
TC4+: L301.4.2 X302.3
TC4-: L302.4.2 X302.4
TEMP_SPI_MISO_DI [Power]: IC301.1.7(A:MISO) IC301.2.7(A:MISO) IC301.3.7(A:MISO) IC301.4.7(A:MISO) ; also sheet 1
TEMP_SPI_SCK_DO [Power]: IC301.1.5(A:SCK) IC301.2.5(A:SCK) IC301.3.5(A:SCK) IC301.4.5(A:SCK) ; also sheet 1
TK1_N: C301.1.2 IC301.1.2(A:T-) L302.1.1
TK1_P: C301.1.1 IC301.1.3(A:T+) L301.1.1
TK2_N: C301.2.2 IC301.2.2(A:T-) L302.2.1
TK2_P: C301.2.1 IC301.2.3(A:T+) L301.2.1
TK3_N: C301.3.2 IC301.3.2(A:T-) L302.3.1
TK3_P: C301.3.1 IC301.3.3(A:T+) L301.3.1
TK4_N: C301.4.2 IC301.4.2(A:T-) L302.4.1
TK4_P: C301.4.1 IC301.4.3(A:T+) L301.4.1
Unconnected: IC301.1.8(A:NC) IC301.2.8(A:NC) IC301.3.8(A:NC) IC301.4.8(A:NC)

### Notes on the sheet
- Type K ambient temperature sensors

## Power pins joined to a net without a drawn wire
5V: U11.L_5V(A:5V)
AGND: U11.R_AGND(B:AGND)
AVDD: U11.R_AVDD(B:AVDD)
E5V: U11.L_E5V(A:E5V)
U5V: U11.R_U5V(B:U5V)
VBAT: U11.L_VBAT(A:VBAT)
VDD: U11.L_VDD(A:VDD)
VIN2: U11.L_VIN(A:VIN2)

## Library data of the parts
51.2 S51.3 S51.4 = A_Schalter:SS_ESP101
C21 C22.1 C22.2 C23.1 C23.2 C31-C34 C41-C44 C45.1 C45.2 C46 C51.1-C51.4 C52.1-C52.4 C53.1-C53.4 C54.1-C54.4 C101.1-C101.4 C102.1-C102.4 C103.1-C103.4 C104.1-C104.4 C105.1-C105.4 C106.1-C106.4 C107.1-C107.4 C151.1 C151.3 C152.1 C152.3 C153.1-C153.4 C301.1-C301.4 C303.1-C303.4 = A_Kondensatoren:C-EU: CAPACITOR, European symbol; PACKAGE: C0603
D51.1-D51.4 D101.1-D101.4 = A_Dioden:DIODE-: DIODE; PACKAGE: SOD-123
D151 D152 = A_Dioden:MM3Z*T1G; PACKAGE: SOD323
IC4 = A_Analog_Devices:AD5664R: D/A-Wandler 4 Kanal 16bit SPI-Interface Lieferant: RS-Components Artikelnummer: 709-5960
IC41 = A_Linear_IC:TL074: OP AMP; PACKAGE: SO-14
IC42 = A_Linear_Technology:LT1004?*; PACKAGE: TO-92
IC51.1-IC51.4 = A_Linear_IC:OPA2156; PACKAGE: SO-08
IC101.1-IC101.4 = A_Linear_Technology:LT1167; PACKAGE: SO-8
IC151.1 IC151.3 = A_Microchip:MCP602: Single Op Amp 2.7V to 6.0V Single Supply CMOS Source: http://ww1.microchip.com/downloads/en/DeviceDoc/21314g.pdf; PACKAGE: SO-08
IC301.1-IC301.4 = A_MAXIM_IC:MAX6675*; PACKAGE: SO-8
JP101.1-JP101.4 = Connectors jumper:JP1E: JUMPER
L21 L31 L101.1-L101.4 L102.1-L102.4 L301.1-L301.4 L302.1-L302.4 = A_Ferrite:FB: FERRITE BEAD; PACKAGE: 2012
R21.1 R21.2 R31-R33 R41 R42.1 R42.2 R43.1 R43.2 R44.1 R44.2 R45.1 R45.2 R46.1 R46.2 R51.1-R51.4 R52.1-R52.4 R53.1-R53.4 R54.1-R54.4 R102.1-R102.4 R103.1-R103.4 R151.1-R151.4 R152.2-R152.4 R153.1-R153.4 R154A R154B R155A R156B R157-R160 R301.1-R301.4 = A_Resistor:R-EU_: RESISTOR, European symbol; PACKAGE: R0603
R34 R41.1 R41.2 = A_Resistor:TRIM_EU-: POTENTIOMETER; PACKAGE: S64Y
R55.1-R55.4 R101.1-R101.4 = A_Resistor:R-EU_: RESISTOR, European symbol; PACKAGE: R0805
S11 = switch-omron:10-XX: OMRON SWITCH; MPN: B3F-1000; OC_FARNELL: 176432; OC_NEWARK: 36M3542
SJ21.1 SJ21.2 = jumper:SJ: SMD solder JUMPER
T151 = A_Transistoren:BSS138PS: BSS138PS Dual N-CH MOSFET 60V, 320mA, 280mW, SOT363 Rdson: 0.9 - 1.6 Ohm Reichelt: BSS138PS NXP Preis: 0,18€; PACKAGE: SOT-363
TP3-TP12 TP17-TP24 TP31 TP32 TP41-TP44 TP45.1 TP45.2 TP46.1 TP46.2 TP47.1 TP47.2 TP51.1-TP51.4 TP52.1-TP52.4 TP53.1-TP53.4 TP54.1-TP54.4 TP55.1-TP55.4 TP101.1-TP101.4 TP102.1-TP102.4 TP103.1-TP103.4 TP104.1-TP104.4 TP105.1-TP105.4 TP106.1-TP106.4 TP107.1-TP107.4 TP151.1-TP151.4 TP152.1-TP152.4 TP153 TP153.1-TP153.4 TP154 = A_Testpoint:TP
U11 = A_Stm32nucleo:NUCLEO_F103_BOT
U21.1 U21.2 = XMC4500_Relax-V1:W25Q80BV
U$2-U$4 U$9 U$10 = WK_frames:A4L-LOC_CC_BY_NC_SA
X101.1-X101.4 = A_Steckverbinder:BU-SMA-G: FEMALE SMA CONNECTOR Radiall distributor RS 193-9117
X301 X302 = Connectors Phoenix-254:MPT4: PHOENIX CONNECTOR

## Net classes
0 default: width 0.61 mm, drill 0.3 mm, clearance 0.2 mm
1 Analog_Sig: width 0.3 mm, drill 0.3 mm, clearance 0.4 mm to class 0, clearance 0.2 mm
2 Digital_Sig: width 0.3 mm, drill 0.3 mm, clearance 0.4 mm to class 0, clearance 0.3 mm to class 1, clearance 0.2 mm
3 Power: width 0.5 mm, drill 0.3 mm, clearance 0.4 mm to class 0, clearance 0.4 mm to class 1, clearance 0.4 mm to class 2, clearance 0.2 mm